# EAGLE design vfd (EAGLE 7.6.0)
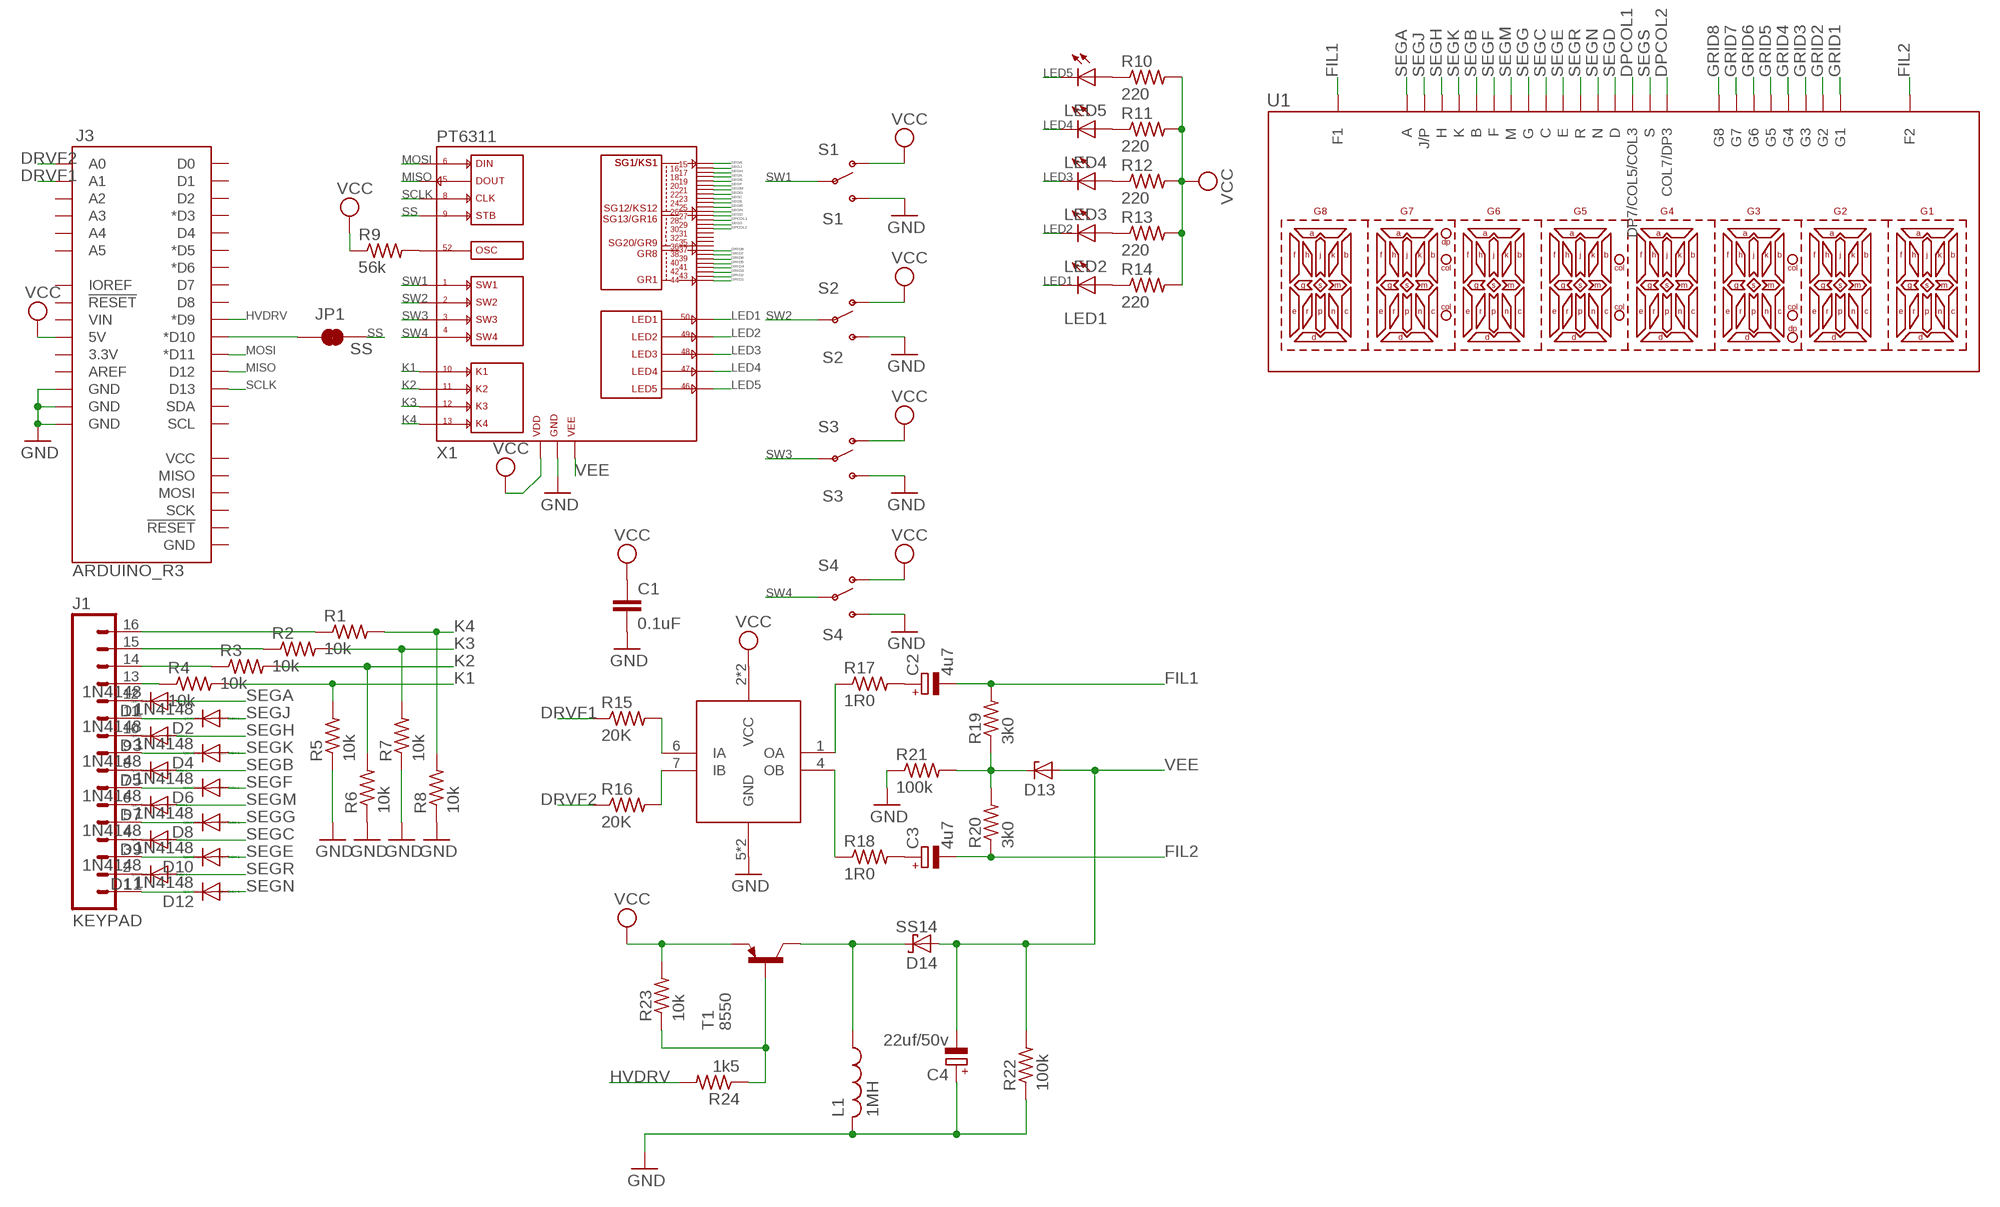
[diagram p0: schematic, sheet 1]

## Parts
C1  0.1uF  C-EU050-025X075  [C050-025X075]
C2  4u7  CPOL-EUB45181A  [B45181A]
C3  4u7  CPOL-EUB45181A  [B45181A]
C4  22uf/50v  CPOL-EUB45181A  [B45181A]
D1  1N4148  DIODE-D-5  [D-5]
D2  1N4148  DIODE-D-5  [D-5]
D3  1N4148  DIODE-D-5  [D-5]
D4  1N4148  DIODE-D-5  [D-5]
D5  1N4148  DIODE-D-5  [D-5]
D6  1N4148  DIODE-D-5  [D-5]
D7  1N4148  DIODE-D-5  [D-5]
D8  1N4148  DIODE-D-5  [D-5]
D9  1N4148  DIODE-D-5  [D-5]
D10  1N4148  DIODE-D-5  [D-5]
D11  1N4148  DIODE-D-5  [D-5]
D12  1N4148  DIODE-D-5  [D-5]
D13  ZENER-DIODEDO34-7  [DO34Z7]
D14  SS14  SCHOTTKY-DIODEDO35-7  [DO35-7]
J1  KEYPAD  M16PTH  [1X16]
J3  ARDUINO_R3  [ARDUINO_R3]
JP1  SS  JUMPER-PAD-2-NC_BY_TRACE  [PAD-JUMPER-2-NC_BY_TRACE_YES_SILK]
L1  1MH  L-US0204/5  [0204/5]
LED1  LED1  LED3MM  [LED3MM]
LED2  LED2  LED3MM  [LED3MM]
LED3  LED3  LED3MM  [LED3MM]
LED4  LED4  LED3MM  [LED3MM]
LED5  LED5  LED3MM  [LED3MM]
R1  10k  R-US_0204/7  [0204/7]
R2  10k  R-US_0204/7  [0204/7]
R3  10k  R-US_0204/7  [0204/7]
R4  10k  R-US_0204/7  [0204/7]
R5  10k  R-US_0204/5  [0204/5]
R6  10k  R-US_0204/5  [0204/5]
R7  10k  R-US_0204/5  [0204/5]
R8  10k  R-US_0204/5  [0204/5]
R9  56k  R-US_0204/5  [0204/5]
R10  220  R-US_0204/5  [0204/5]
R11  220  R-US_0204/5  [0204/5]
R12  220  R-US_0204/5  [0204/5]
R13  220  R-US_0204/5  [0204/5]
R14  220  R-US_0204/5  [0204/5]
R15  20K  R-US_0204/5  [0204/5]
R16  20K  R-US_0204/5  [0204/5]
R17  1R0  R-US_0204/5  [0204/5]
R18  1R0  R-US_0204/5  [0204/5]
R19  3k0  R-US_0204/7  [0204/7]
R20  3k0  R-US_0204/7  [0204/7]
R21  100k  R-US_0204/7  [0204/7]
R22  100k  R-US_0204/5  [0204/5]
R23  10k  R-US_0204/5  [0204/5]
R24  1k5  R-US_0204/5  [0204/5]
S1  S1  SWITCH-SPDTPTH  [SWITCH-SPDT]
S2  S2  SWITCH-SPDTPTH  [SWITCH-SPDT]
S3  S3  SWITCH-SPDTPTH  [SWITCH-SPDT]
S4  S4  SWITCH-SPDTPTH  [SWITCH-SPDT]
T1  8550  -PNP-TO92  [TO92]
U1  20070-1A04PTH  [20070-1A04]
U$1  L9110  [SOP8-1.27-5X3.6MM]
X1  DRV  PT6311  [QFP52]

## Nets
DPCOL1: U1.17(DP7/COL5/COL3) X1.P$28(SG14/GR15)
DPCOL2: U1.19(COL7/DP3) X1.P$30(SG16/GR13)
DRVF1: J3.A1 R15.1
DRVF2: J3.A0 R16.1
FIL1: C2.- R19.2 U1.1(F1) U1.2(F1)
FIL2: C3.- R20.1 U1.29(F2) U1.30(F2)
GND: C1.2 C4.+ J3.GND@2(GND) J3.GND@3(GND) J3.GND@4(GND) L1.2 R5.1 R6.1 R7.1 R8.1 R21.1 R22.1 S1.3(S) S2.3(S) S3.3(S) S4.3(S) U$1.5(GND) U$1.8(GND) X1.P$51(GND)
GRID1: U1.27(G1) X1.P$44(GR1)
GRID2: U1.26(G2) X1.P$43(GR2)
GRID3: U1.25(G3) X1.P$42(GR3)
GRID4: U1.24(G4) X1.P$41(GR4)
GRID5: U1.23(G5) X1.P$40(GR5)
GRID6: U1.22(G6) X1.P$39(GR6)
GRID7: U1.21(G7) X1.P$38(GR7)
GRID8: U1.20(G8) X1.P$37(GR8)
HVDRV: J3.D9(*D9) R24.2
K1: R4.2 R5.2 X1.P$10(K1)
K2: R3.2 R6.2 X1.P$11(K2)
K3: R2.2 R7.2 X1.P$12(K3)
K4: R1.2 R8.2 X1.P$13(K4)
LED1: LED1.K(C) X1.P$50(LED1)
LED2: LED2.K(C) X1.P$49(LED2)
LED3: LED3.K(C) X1.P$48(LED3)
LED4: LED4.K(C) X1.P$47(LED4)
LED5: LED5.K(C) X1.P$46(LED5)
MISO: J3.D12 X1.P$5(DOUT)
MOSI: J3.D11(*D11) X1.P$6(DIN)
N$1: D1.C J1.12
N$2: D2.C J1.11
N$3: D3.C J1.10
N$4: D4.C J1.9
N$5: D5.C J1.8
N$6: D6.C J1.7
N$7: D7.C J1.6
N$8: D8.C J1.5
N$9: D9.C J1.4
N$10: D10.C J1.3
N$11: D11.C J1.2
N$12: D12.C J1.1
N$13: J1.16 R1.1
N$15: J1.15 R2.1
N$16: J1.14 R3.1
N$17: J1.13 R4.1
N$18: J3.D10(*D10) JP1.1
N$20: R9.2 X1.P$52(OSC)
N$21: LED5.A R10.1
N$22: LED4.A R11.1
N$23: LED3.A R12.1
N$24: LED2.A R13.1
N$25: LED1.A R14.1
N$26: R15.2 U$1.6(IA)
N$27: R16.2 U$1.7(IB)
N$28: R17.1 U$1.1(OA)
N$29: R18.1 U$1.4(OB)
N$30: C2.+ R17.2
N$31: C3.+ R18.2
N$35: D13.C R19.1 R20.2 R21.2
N$36: R23.1 R24.1 T1.2(B)
N$40: D14.C L1.1 T1.3(C)
SCLK: J3.D13 X1.P$8(CLK)
SEGA: D1.A U1.4(A) X1.P$15(SG1/KS1)
SEGB: D5.A U1.8(B) X1.P$19(SG5/KS5)
SEGC: D9.A U1.12(C) X1.P$23(SG9/KS9)
SEGD: U1.16(D) X1.P$27(SG13/GR16)
SEGE: D10.A U1.13(E) X1.P$24(SG10/KS10)
SEGF: D6.A U1.9(F) X1.P$20(SG6/KS6)
SEGG: D8.A U1.11(G) X1.P$22(SG8/KS8)
SEGH: D3.A U1.6(H) X1.P$17(SG3/KS3)
SEGJ: D2.A U1.5(J/P) X1.P$16(SG2/KS2)
SEGK: D4.A U1.7(K) X1.P$18(SG4/KS4)
SEGM: D7.A U1.10(M) X1.P$21(SG7/KS7)
SEGN: D12.A U1.15(N) X1.P$26(SG12/KS12)
SEGR: D11.A U1.14(R) X1.P$25(SG11/KS11)
SEGS: U1.18(S) X1.P$29(SG15/GR14)
SS: JP1.2 X1.P$9(STB)
SW1: S1.2(P) X1.P$1(SW1)
SW2: S2.2(P) X1.P$2(SW2)
SW3: S3.2(P) X1.P$3(SW3)
SW4: S4.2(P) X1.P$4(SW4)
VCC: C1.1 J3.5V R9.1 R10.2 R11.2 R12.2 R13.2 R14.2 R23.2 S1.1(O) S2.1(O) S3.1(O) S4.1(O) T1.1(E) U$1.2(VCC) U$1.3(VCC) X1.P$14(VDD) X1.P$33(VDD) X1.P$45(VDD)
VEE: C4.- D13.A D14.A R22.2 X1.P$34(VEE)
Unconnected: J3.3.3V J3.A2 J3.A3 J3.A4 J3.A5 J3.AREF J3.D0 J3.D1 J3.D2 J3.D3(*D3) J3.D4 J3.D5(*D5) J3.D6(*D6) J3.D7 J3.D8 J3.GND@1(GND) J3.IOREF J3.MISO J3.MOSI J3.RESET@1(!RESET!) J3.RESET@2(!RESET!) J3.SCK J3.SCL J3.SDA J3.VCC J3.VIN X1.P$31(SG17/GR12) X1.P$32(SG18/GR11) X1.P$35(SG19/GR10) X1.P$36(SG20/GR9)

## Library data of the parts
C1 = resistor:C-EU: CAPACITOR, European symbol
C2-C4 = resistor:CPOL-EU: POLARIZED CAPACITOR, European symbol
D1-D12 = diode:DIODE-: DIODE
D13 = diode:ZENER-DIODE: Z-Diode
D14 = diode:SCHOTTKY-DIODE: Schottky Diode
J1 = SparkFun-Connectors:M16: 1x16 .1" header
J3 = SparkFun-Boards:ARDUINO_R3: Arduino R3 Footprint (w/ SPI header)
JP1 = SparkFun-Passives:JUMPER-PAD-2-NC_BY_TRACE
L1 = resistor:L-US: INDUCTOR, American symbol
LED1-LED5 = led:LED: LED OSRAM: - CHIPLED LG R971, LG N971, LY N971, LG Q971, LY Q971, LO R971, LY R971 LH N974, LH R974 LS Q976, LO Q976, LY Q976 LO Q996 - Hyper CHIPLED LW Q18S LB Q993, LB Q99A, LB R99A - SideLED LS A670, LO A670, LY A670, LG A670, LP A670 LB A673, LV A673, LT A673, LW A673 LH A674 LY A675 LS A676, LA A676, LO A676, LY A676, LW A676 LS A679, LY A679, LG A679 - Hyper Micro SIDELED® LS Y876, LA Y876, LO Y876, LY Y876 LT Y87S - SmartLED LW L88C, LW L88S LB L89C, LB L89S, LG L890 LS L89K, LO L89K, LY L89K LS L896, LA L896, LO L896, LY L896 - TOPLED LS T670, LO T670, LY T670, LG T670, LP T670 LSG T670, LSP T670, LSY T670, LOP T670, LYG T670 LG T671, LOG T671, LSG T671 LB T673, LV T673, LT T673, LW T673 LH T674 LS T676, LA T676, LO T676, LY T676, LB T676, LH T676, LSB T676, LW T676 LB T67C, LV T67C, LT T67C, LS T67K, LO T67K, LY T67K, LW E67C LS E67B, LA E67B, LO E67B, LY E67B, LB E67C, LV E67C, LT E67C LW T67C LS T679, LY T679, LG T679 LS T770, LO T770, LY T770, LG T770, LP T770 LB T773, LV T773, LT T773, LW T773 LH T774 LS E675, LA E675, LY E675, LS T675 LS T776, LA T776, LO T776, LY T776, LB T776 LHGB T686 LT T68C, LB T68C - Hyper Mini TOPLED® LB M676 - Mini TOPLED Santana® LG M470 LS M47K, LO M47K, LY M47K Source: http://www.osram.convergy.de LUXEON: - LUMILED® LXK2-PW12-R00, LXK2-PW12-S00, LXK2-PW14-U00, LXK2-PW14-V00 LXK2-PM12-R00, LXK2-PM12-S00, LXK2-PM14-U00 LXK2-PE12-Q00, LXK2-PE12-R00, LXK2-PE12-S00, LXK2-PE14-T00, LXK2-PE14-U00 LXK2-PB12-K00, LXK2-PB12-L00, LXK2-PB12-M00, LXK2-PB14-N00, LXK2-PB14-P00, LXK2-PB14-Q00 LXK2-PR12-L00, LXK2-PR12-M00, LXK2-PR14-Q00, LXK2-PR14-R00 LXK2-PD12-Q00, LXK2-PD12-R00, LXK2-PD12-S00 LXK2-PH12-R00, LXK2-PH12-S00 LXK2-PL12-P00, LXK2-PL12-Q00, LXK2-PL12-R00 Source: www.luxeon.com KINGBRIGHT: KA-3528ASYC Source: www.kingbright.com
R1-R24 = resistor:R-US_: RESISTOR, American symbol
S1-S4 = SparkFun-Electromechanical:SWITCH-SPDT: SPDT Switch Simple slide switch, Spark Fun Electronics SKU : COM-00102 DPDT SMT slide switch, AYZ0202, SWCH-08179; PROD_ID: SWCH-08261
T1 = transistor:*-PNP-: PNP Transistror
U1 = VFD:20070-1A04: AOTOM 20070-1A04 Alphanumeric VFD
U$1 = Drivers:L9110
X1 = Drivers:PT6311: PT6311 VFD Driver PT6311 is a Vacuum Fluorescent Display (VFD) Controller driven on a 1/8 to 1/16 duty factor housed in 52-pin plastic QFP Package. Twelve segment output lines, 8 grid output lines, 8 segment/grid output drive lines, one display memory, control circuit, key scan circuit are all incorporated into a single chip to build a highly reliable peripheral device for a single chip micro computer. Serial data is fed to PT6311 via a three-line serial interface.

## Board
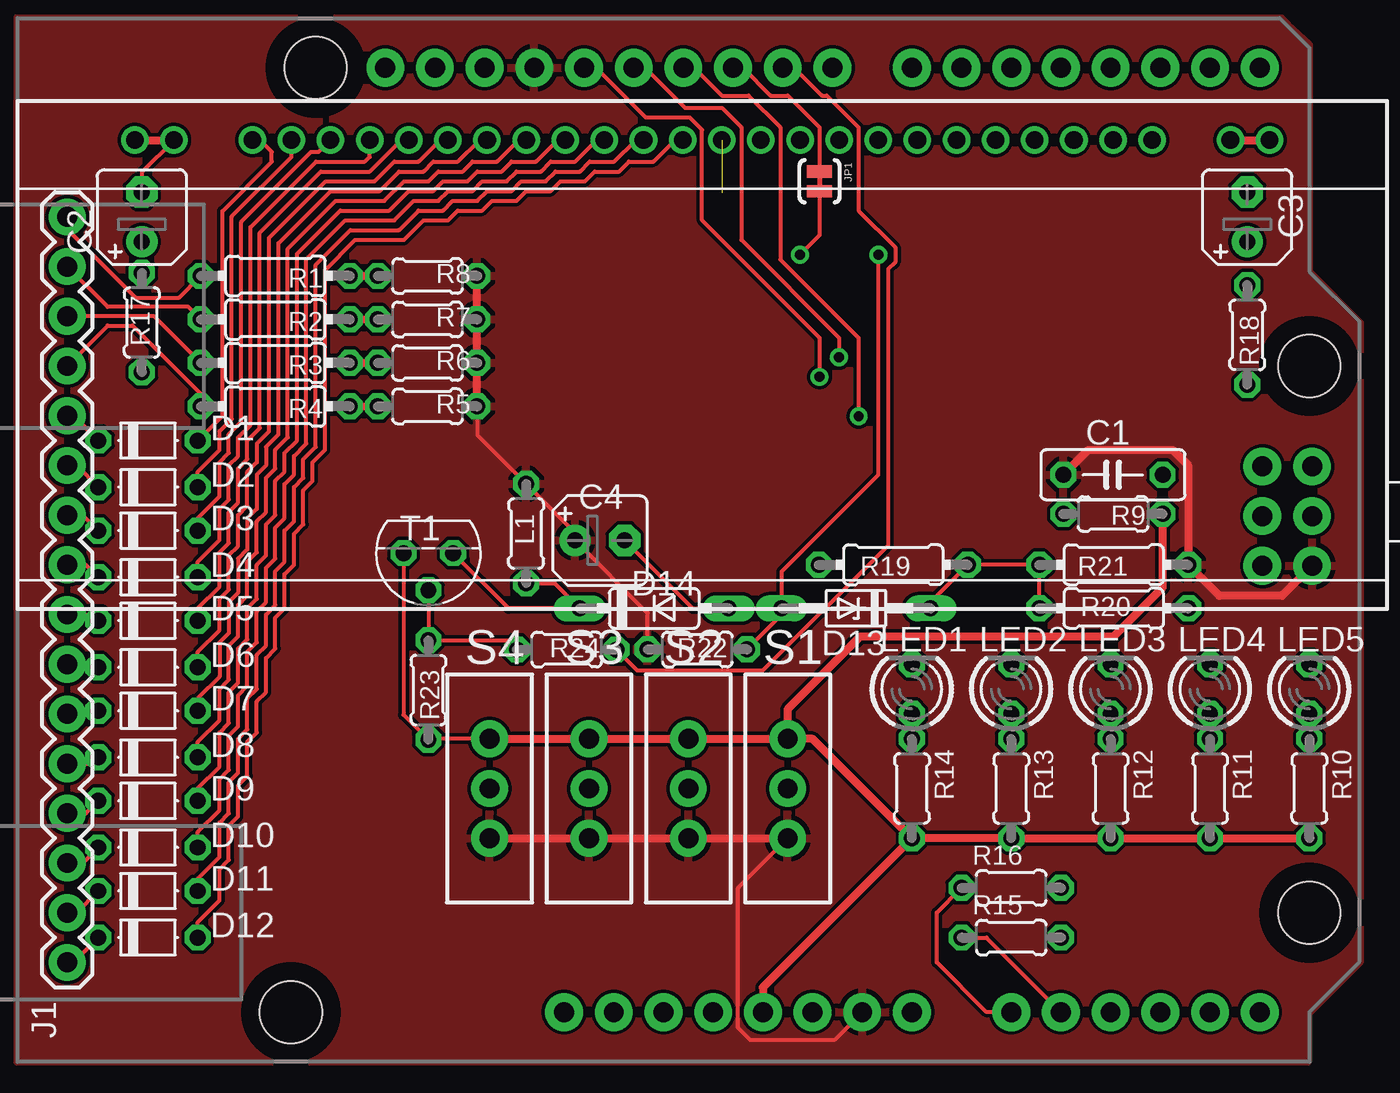
[diagram p1: board, top side]
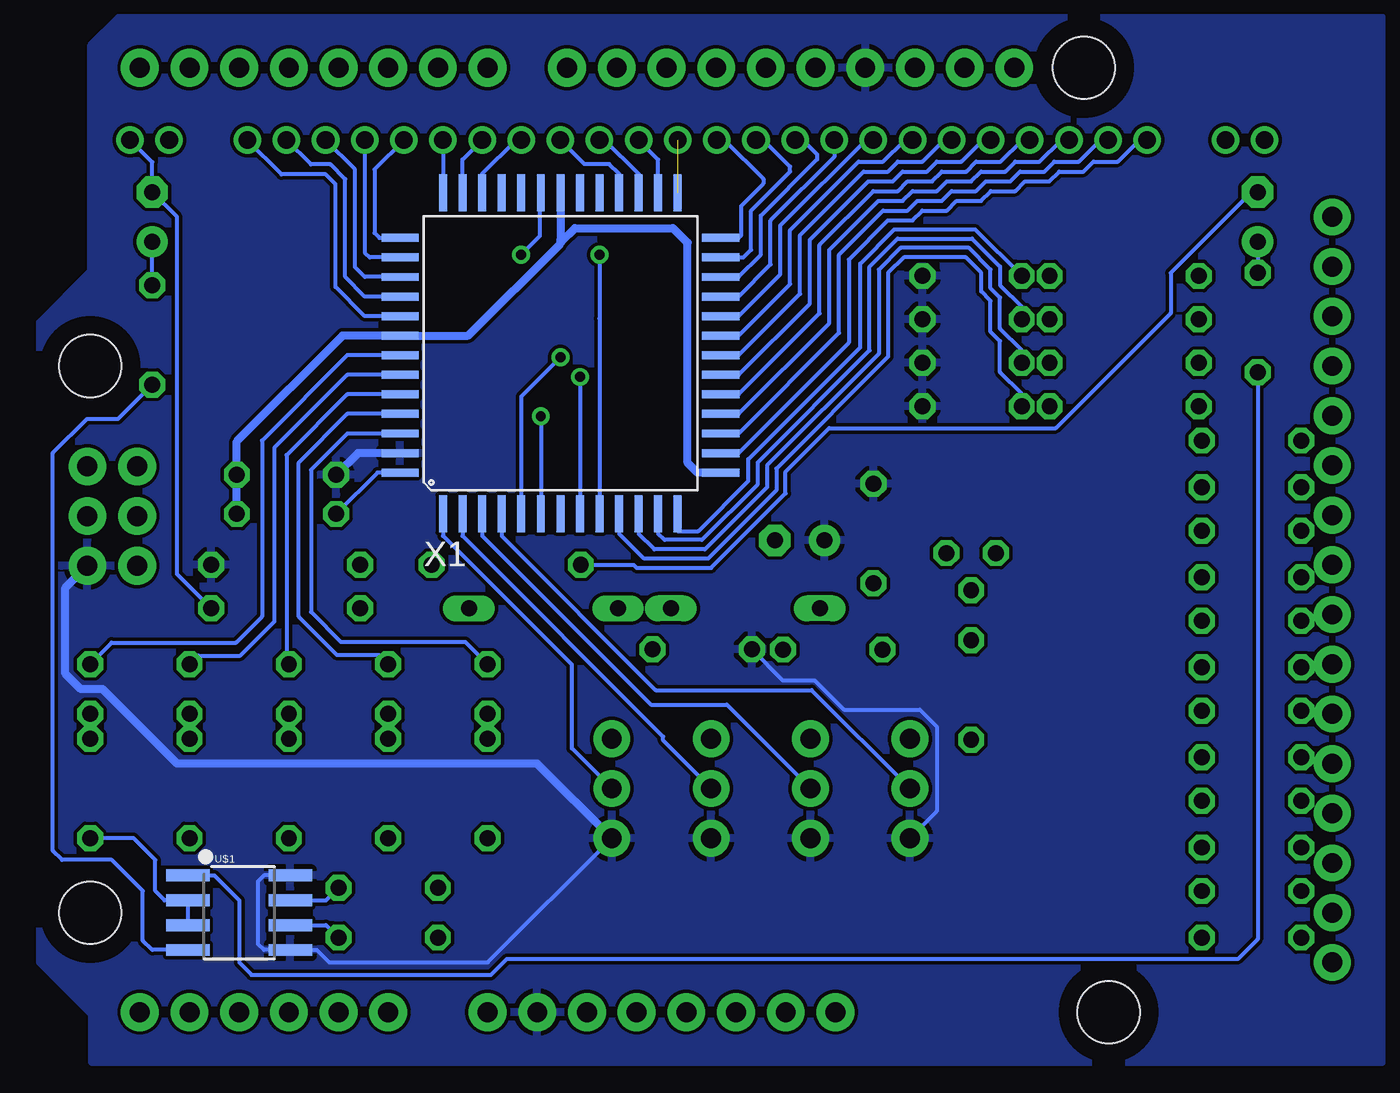
[diagram p2: board, bottom side, seen from below]

No outline drawn. Coordinates in mm, seen from the top.
Copper layers (1*16): Top 0.035mm / dielectric 1.5mm / Bottom 0.035mm
Design rules "default *": minimum track width 8mil, minimum drill 20mil, track to track 7mil, track to pad 7mil, pad to pad 7mil, via to via 7mil, smd to smd 7mil, copper to edge 38mil, drill to drill 8mil, minimum pad ring 10mil, minimum via ring 8mil, stop-mask expansion 4mil, vias tented up to drill 0mil, thermal gap 10mil

### Footprints (pad centres in the part's own frame; a part is rotated, then mirrored left to right if it is on the bottom)
C050-025X075 = drill 0.813 octagon: 1 -2.54,0; 2 2.54,0
B45181A = drill 0.813 pad 1.6: + -1.27,0 | drill 0.813 pad 1.6 octagon: - 1.27,0
D-5 = drill 0.813 octagon: A 2.54,0; C -2.54,0
DO34Z7 = drill 0.813 long: A 3.81,0; C -3.81,0
DO35-7 = drill 0.813 long: A 3.81,0; C -3.81,0
1X16 = drill 1.016 pad 1.88: 1 0,0; 2 2.54,0; 3 5.08,0; 4 7.62,0; 5 10.16,0; 6 12.7,0; 7 15.24,0; 8 17.78,0; 9 20.32,0; 10 22.86,0; 11 25.4,0; 12 27.94,0; 13 30.48,0; 14 33.02,0; 15 35.56,0; 16 38.1,0
ARDUINO_R3 = drill 1.016 pad 1.93: 3.3V 35.56,2.54; 5V 38.1,2.54; A0 50.8,2.54; A1 53.34,2.54; A2 55.88,2.54; A3 58.42,2.54; A4 60.96,2.54; A5 63.5,2.54; AREF 23.876,50.8; D0 63.5,50.8; D1 60.96,50.8; D2 58.42,50.8; D3 55.88,50.8; D4 53.34,50.8; D5 50.8,50.8; D6 48.26,50.8; D7 45.72,50.8; D8 41.656,50.8; D9 39.116,50.8; D10 36.576,50.8; D11 34.036,50.8; D12 31.496,50.8; D13 28.956,50.8; GND@1 40.64,2.54; GND@2 43.18,2.54; GND@3 26.416,50.8; GND@4 66.18,25.35; IOREF 30.48,2.54; MISO 63.64,30.43; MOSI 66.18,27.89; NC 27.94,2.54; RESET@1 33.02,2.54; RESET@2 63.64,25.35; SCK 63.64,27.89; SCL 18.796,50.8; SDA 21.336,50.8; VCC 66.18,30.43; VIN 45.72,2.54 | hole 3.175: 15.24,50.8; 66.04,35.56; 66.04,7.62; 13.97,2.54
PAD-JUMPER-2-NC_BY_TRACE_YES_SILK = smd 0.635 x 1.27: 1 -0.508,0; 2 0.508,0
0204/5 = drill 0.813 octagon: 1 -2.54,0; 2 2.54,0
LED3MM = drill 0.813 octagon: A -1.27,0; K 1.27,0
0204/7 = drill 0.813 octagon: 1 -3.81,0; 2 3.81,0
SWITCH-SPDT = drill 1.016 pad 1.88: 1 0,2.54; 2 0,0; 3 0,-2.54
TO92 = drill 0.813 octagon: 1 1.27,0; 2 0,1.905; 3 -1.27,0
20070-1A04 = drill 0.9: 1 6,24; 2 8,24; 4 12,24; 5 14,24; 6 16,24; 7 18,24; 8 20,24; 9 22,24; 10 24,24; 11 26,24; 12 28,24; 13 30,24; 14 32,24; 15 34,24; 16 36,24; 17 38,24; 18 40,24; 19 42,24; 20 44,24; 21 46,24; 22 48,24; 23 50,24; 24 52,24; 25 54,24; 26 56,24; 27 58,24; 29 62,24; 30 64,24
SOP8-1.27-5X3.6MM = smd 0.61 x 2.21: 1 -1.905,-2.616; 2 -0.635,-2.616; 3 0.635,-2.616; 4 1.905,-2.616; 5 1.905,2.616; 6 0.635,2.616; 7 -0.635,2.616; 8 -1.905,2.616
QFP52 = smd 0.406 x 1.9: P$1 -6,-8.1; P$2 -5,-8.1; P$3 -4,-8.1; P$4 -3,-8.1; P$5 -2,-8.1; P$6 -1,-8.1; P$7 0,-8.1; P$8 1,-8.1; P$9 2,-8.1; P$10 3,-8.1; P$11 4,-8.1; P$12 5,-8.1; P$13 6,-8.1; P$27 6,8.3; P$28 5,8.3; P$29 4,8.3; P$30 3,8.3; P$31 2,8.3; P$32 1,8.3; P$33 0,8.3; P$34 -1,8.3; P$35 -2,8.3; P$36 -3,8.3; P$37 -4,8.3; P$38 -5,8.3; P$39 -6,8.3 | smd 1.9 x 0.406: P$14 8.2,-6; P$15 8.2,-5; P$16 8.2,-4; P$17 8.2,-3; P$18 8.2,-2; P$19 8.2,-1; P$20 8.2,0; P$21 8.2,1; P$22 8.2,2; P$23 8.2,3; P$24 8.2,4; P$25 8.2,5; P$26 8.2,6; P$40 -8.2,6; P$41 -8.2,5; P$42 -8.2,4; P$43 -8.2,3; P$44 -8.2,2; P$45 -8.2,1; P$46 -8.2,0; P$47 -8.2,-1; P$48 -8.2,-2; P$49 -8.2,-3; P$50 -8.2,-4; P$51 -8.2,-5; P$52 -8.2,-6

### Placement (x,y rotation side)
C1  56,30 180 top
C2  6.35,43.18 90 top
C3  62.87,43.18 90 top
C4  29.77,26.65 0 top
D1  6.67,31.75 0 top
D2  6.67,29.37 0 top
D3  6.67,27.15 0 top
D4  6.67,24.77 0 top
D5  6.67,22.54 0 top
D6  6.67,20.16 0 top
D7  6.67,17.94 0 top
D8  6.67,15.56 0 top
D9  6.67,13.34 0 top
D10  6.67,10.95 0 top
D11  6.67,8.73 0 top
D12  6.67,6.35 0 top
D13  42.86,23.18 180 top
D14  32.54,23.18 0 top
J1  2.54,5.08 90 top
J3  0,0 0 top
JP1  41,45 270 top
L1  26,27 90 top
LED1  45.72,19.05 90 top
LED2  50.8,19.05 90 top
LED3  55.88,19.05 90 top
LED4  60.96,19.05 90 top
LED5  66.04,19.05 90 top
R1  13.18,40.16 0 top
R2  13.18,37.94 0 top
R3  13.18,35.72 0 top
R4  13.18,33.5 0 top
R5  20.95,33.5 180 top
R6  20.95,35.72 180 top
R7  20.95,37.94 180 top
R8  20.95,40.16 180 top
R9  56,28 180 top
R10  66.04,13.97 270 top
R11  60.96,13.97 270 top
R12  55.88,13.97 270 top
R13  50.8,13.97 270 top
R14  45.72,13.97 270 top
R15  50.8,6.35 0 top
R16  50.8,8.89 0 top
R17  6.35,37.78 90 top
R18  62.87,37.15 90 top
R19  44.77,25.4 180 top
R20  56.04,23.18 180 top
R21  56.04,25.4 180 top
R22  34.75,21.08 0 top
R23  21,19 270 top
R24  28.07,21.07 0 top
S1  39.37,13.97 0 top
S2  34.29,13.97 0 top
S3  29.21,13.97 0 top
S4  24.13,13.97 0 top
T1  21,26 180 top
U1  0,23.11 0 top
U$1  58.42,7.62 270 bottom
X1  42,36.11 0 bottom

### Tracks (layer width: path | path; a pad name or v marks a point on that pad's centre or on a via)
DPCOL1
  Bottom 0.203: X1.P$28 37,46.11 U1.17
DPCOL2
  Bottom 0.203: X1.P$30 39,45.38 39.5,45.88 40.77,45.88 U1.19
DRVF1
  Top 0.203: R15.1 49.53,6.35 J3.A1
DRVF2
  Top 0.203: J3.A0 49.53,2.54 46.99,5.08 46.99,7.62 R16.1
FIL1
  Top 0.203: U1.2 6.35,45.46 C2.-
  Top 0.406: U1.1 U1.2
  Bottom 0.203: C2.- 6.67,44.45 10.79,40.32 10.79,38.26 16.67,32.38 28.26,32.38 30.48,30.16 30.48,29.05 34.29,25.24 38.1,25.24 38.26,25.4 R19.2
FIL2
  Top 0.406: U1.29 U1.30
  Bottom 0.203: U1.30 62.87,45.98 C3.- 61.59,43.18 61.59,24.92 R20.1
GND
  Top 0.203: R5.1 23.5,32.05 L1.2 28.5,27.04 C4.+ 32.21,22.93 R22.1 | J3.GND@2 41.75,1.11 37.47,1.11 36.83,1.75 36.83,8.89 S1.3
  Top 0.406: S1.3 S2.3 S3.3 S4.3 | R5.1 R6.1 R7.1 R8.1 | J3.GND@4 64.64,23.81 61.44,23.81 R21.1 59.85,30.48 59.05,31.27 54.73,31.27 C1.2
  Bottom 0.203: U$1.8 57.15,9.53 57.47,9.21 57.47,6.03 57.15,5.71 U$1.5 54.45,5.71 53.82,5.08 45.72,5.08 S1.3 | R22.1 30.64,19.5 29,19.5 27.5,18 23.62,18 22.75,17.12 22.75,12.81 S4.3
  Bottom 0.406: X1.P$51 52.35,31.11 C1.2 | S1.3 43.18,15.24 61.59,15.24 65.41,19.05 66.52,19.05 67.31,19.84 67.31,24.22 J3.GND@4
  pour Bottom: 0,53.36 64.58,53.34 66,51.92 66,40.38 68.62,37.75 68.62,5.12 65.95,2.46 65.95,0 0,0
  pour Top: 0,53.36 64.58,53.34 64.92,53 66,52 66,40.38 68.62,37.75 68.62,5.12 65.95,2.46 65.95,0 0,0
GRID1
  Bottom 0.203: X1.P$44 52,38.11 53.5,39.61 53.5,44.86 54,45.36 56.25,45.36 U1.27
GRID2
  Bottom 0.203: X1.P$43 52,39.11 53,40.11 53,45.11 53.75,45.86 54.75,45.86 U1.26
GRID3
  Bottom 0.203: X1.P$42 52,40.11 52.5,40.61 52.5,45.61 U1.25
GRID4
  Bottom 0.203: U1.24 52,41.36 51.75,41.11 X1.P$41
GRID5
  Bottom 0.203: U1.23 51.5,45.61 51.5,42.36 51.25,42.11 X1.P$40
GRID6
  Bottom 0.203: U1.22 X1.P$39
GRID7
  Bottom 0.203: X1.P$38 47,46.11 U1.21
GRID8
  Bottom 0.203: X1.P$37 46,45.38 44.27,47.11 U1.20
HVDRV
  Top 0.203: R24.2 31.68,20 38.1,20 44.5,26.38 44.5,40.5 44.88,40.88 44.88,41.62 43,43.5 43,47.75 41.38,49.38 41.12,49.38 39.7,50.8 J3.D9
K1
  Top 0.406: R4.2 R5.2
  Bottom 0.203: R5.2 18.41,34.13 19.53,35.24 19.53,36.83 20,37.31 20,38.89 20.48,39.37 20.48,40.32 21.27,41.12 24.45,41.12 25.24,40.32 25.24,36.04 30.96,30.32 30.96,29.21 34.45,25.72 37.72,25.72 39,27 X1.P$10
K2
  Top 0.406: R3.2 R6.2
  Bottom 0.203: R6.2 18.41,36.35 19.53,37.47 19.53,39.05 20,39.53 20,40.48 21.11,41.59 24.61,41.59 25.72,40.48 25.72,36.2 31.43,30.48 31.43,29.37 34.61,26.19 37.19,26.19 38,27 X1.P$11
K3
  Top 0.406: R2.2 R7.2
  Bottom 0.203: R7.2 18.41,38.58 19.53,39.69 19.53,40.64 20.95,42.07 24.77,42.07 26.19,40.64 26.19,36.35 31.91,30.64 31.91,29.53 34.77,26.67 36.67,26.67 37,27 X1.P$12
K4
  Top 0.406: R1.2 R8.2
  Bottom 0.203: R8.2 20.8,42.55 24.92,42.55 26.67,40.8 26.67,36.51 32.38,30.8 32.38,29.69 34.95,27.12 36,27.12 X1.P$13
LED1
  Bottom 0.203: X1.P$50 52.89,32.11 54.75,30.25 54.75,23 53.2,21.45 46.85,21.45 LED1.K
LED2
  Bottom 0.203: X1.P$49 52.89,33.11 55.38,30.62 55.38,22.75 53.41,20.79 51.27,20.79 LED2.K
LED3
  Bottom 0.203: X1.P$48 52.89,34.11 56,31 56,20.44 LED3.K
LED4
  Bottom 0.203: X1.P$47 52.89,35.11 56.62,31.38 56.62,22.5 58.36,20.76 60.52,20.76 LED4.K
LED5
  Bottom 0.203: X1.P$46 52.89,36.11 57.25,31.75 57.25,22.75 58.58,21.42 64.94,21.42 LED5.K
MISO  (via drill 0.51)
  Top 0.203: v42,36 42,37 37,42 37,47.75 36,48.75 34.12,48.75 32.08,50.8 J3.D12
  Bottom 0.203: X1.P$5 44,34 v42,36
MOSI  (via drill 0.51)
  Top 0.203: v43,33 43,37 39,41 39,47.75 37.38,49.38 36,49.38 34.58,50.8 J3.D11
  Bottom 0.203: v43,33 X1.P$6
N$1
  Top 0.203: J1.12 2.86,33.02 D1.C
N$2
  Top 0.203: J1.11 3.02,30.48 D2.C
N$3
  Top 0.203: J1.10 3.33,27.94 D3.C
N$4
  Top 0.203: J1.9 3.49,25.4 D4.C
N$5
  Top 0.203: J1.8 3.81,22.86 D5.C
N$6
  Top 0.203: J1.7 3.97,20.32 D6.C
N$7
  Top 0.203: J1.6 3.97,17.78 D7.C
N$8
  Top 0.203: J1.5 3.81,15.24 D8.C
N$9
  Top 0.203: J1.4 3.49,12.7 D9.C
N$10
  Top 0.203: J1.3 3.33,10.16 D10.C
N$11
  Top 0.203: J1.2 3.02,7.62 D11.C
N$12
  Top 0.203: J1.1 2.86,5.08 D12.C
N$13
  Top 0.203: J1.16 2.54,42.55 6.03,39.05 8.26,39.05 R1.1
N$15
  Top 0.203: R2.1 8.73,38.58 4.6,38.58 J1.15
N$16
  Top 0.203: R3.1 6.99,38.1 J1.14
N$17
  Top 0.203: J1.13 4.6,37.62 5.87,37.62 9.37,34.13 R4.1
N$18
  Top 0.203: J3.D10 37.08,50.8 38.5,49.38 39.38,49.38 41,47.75 JP1.1
N$20
  Bottom 0.203: X1.P$52 51.35,30.11 R9.2
N$21
  Top 0.406: LED5.A R10.1
N$22
  Top 0.406: LED4.A R11.1
N$23
  Top 0.406: LED3.A R12.1
N$24
  Top 0.406: LED2.A R13.1
N$25
  Top 0.406: LED1.A R14.1
N$26
  Bottom 0.203: U$1.6 53.98,6.99 R15.2
N$27
  Bottom 0.203: U$1.7 53.98,8.26 R16.2
N$28
  Bottom 0.203: U$1.1 59.69,9.53 58.42,8.26 58.42,5.08 57.78,4.45 45.55,4.45 44.75,5.25 7.37,5.25 6.35,6.27 R17.1
N$29
  Bottom 0.203: U$1.4 62.87,5.71 63.34,6.19 63.34,8.73 64.93,10.32 67.47,10.32 67.94,10.79 67.94,31.11 66.2,32.86 64.61,32.86 R18.1
N$30
  Bottom 0.203: C2.+ R17.2
N$31
  Bottom 0.203: R18.2 C3.+
N$35
  Top 0.203: R20.2 R21.2 R19.1 46.67,23.5 D13.C
N$36
  Top 0.203: T1.2 R23.1 25.06,21.54 R24.1
N$40
  Top 0.203: T1.3 25.09,23.18 D14.C 27.45,24.46 L1.1
SCLK  (via drill 0.51)
  Top 0.203: v41,35 41,37 35,43 35,47.62 34.38,48.25 32.12,48.25 29.57,50.8 J3.D13
  Bottom 0.203: v41,35 X1.P$8
SEGA
  Top 0.203: U1.4 12.39,47.11 13,46.5 13,46 10.48,43.48 10.48,33.02 D1.A
  Bottom 0.203: U1.4 12.39,47.11 13.5,46 14.75,46 15.25,45.5 16.5,45.5 17,45 18.25,45 18.75,44.5 20,44.5 20.5,44 21.75,44 22.25,43.5 23.5,43.5 24,43 25.25,43 27.25,41 27.25,36.75 32.89,31.11 X1.P$15
SEGB
  Top 0.203: U1.8 19.61,47.11 18,45.5 15.5,45.5 12.38,42.38 12.38,32.38 11.75,31.75 11.75,30.8 11.27,30.32 11.27,28.57 10.79,28.1 10.79,26.51 10.32,26.04 10.32,24.29 9.21,23.18 D5.A
  Bottom 0.203: X1.P$19 32.89,35.11 29.25,38.75 29.25,42 26.25,45 25,45 24.5,45.5 23.25,45.5 22.75,46 21.5,46 20.39,47.11 U1.8
SEGC
  Top 0.203: U1.12 27.61,47.11 26.5,46 25.25,46 24.75,45.5 23.5,45.5 23,45 21.75,45 21.25,44.5 20,44.5 19,43.5 16.5,43.5 14.29,41.29 14.29,31.75 13.65,31.11 13.65,30.16 13.18,29.69 13.18,27.94 12.7,27.46 12.7,25.88 12.22,25.4 12.22,23.65 11.75,23.18 11.75,21.59 11.27,21.11 11.27,19.37 10.79,18.89 10.79,17.3 10.32,16.83 10.32,15.08 9.21,13.97 D9.A
  Bottom 0.203: X1.P$23 32.89,39.11 31.25,40.75 31.25,43 28,46.25 U1.12
SEGD  (1 unrouted)
SEGE
  Top 0.203: U1.13 29.61,47.11 28.5,46 27.25,46 26.75,45.5 25.5,45.5 25,45 23.75,45 23.25,44.5 22,44.5 21.5,44 20.25,44 19.25,43 16.75,43 14.76,41.01 14.76,31.59 14.13,30.96 14.13,30 13.65,29.53 13.65,27.78 13.18,27.3 13.18,25.72 12.7,25.24 12.7,23.5 12.22,23.02 12.22,21.43 11.75,20.95 11.75,19.21 11.27,18.73 11.27,17.14 10.79,16.67 10.79,14.92 10.32,14.45 10.32,12.86 9.21,11.75 D10.A
  Bottom 0.203: X1.P$24 32.89,40.11 31.75,41.25 31.75,43.25 28.88,46.12 28.88,46.38 29.61,47.11 U1.13
SEGF
  Top 0.203: U1.9 21.61,47.11 20.5,46 19.25,46 18.25,45 15.75,45 12.86,42.11 12.86,32.23 12.22,31.59 12.22,30.64 11.75,30.16 11.75,28.42 11.27,27.94 11.27,26.35 10.79,25.88 10.79,24.13 10.32,23.65 10.32,22.07 9.21,20.95 D6.A
  Bottom 0.203: X1.P$20 32.89,36.11 29.75,39.25 29.75,42.25 26.5,45.5 25.25,45.5 24.75,46 23.5,46 22.39,47.11 U1.9
SEGG
  Top 0.203: U1.11 25.61,47.11 24.5,46 23.25,46 22.75,45.5 21.5,45.5 21,45 19.75,45 18.75,44 16.25,44 13.81,41.56 13.81,31.91 13.18,31.27 13.18,30.32 12.7,29.84 12.7,28.1 12.22,27.62 12.22,26.04 11.75,25.56 11.75,23.81 11.27,23.34 11.27,21.75 10.79,21.27 10.79,19.53 10.32,19.05 10.32,17.46 9.21,16.35 D8.A
  Bottom 0.203: X1.P$22 32.89,38.11 30.75,40.25 30.75,42.75 26.39,47.11 U1.11
SEGH
  Top 0.203: U1.6 15.39,46.5 15,46.5 11.43,42.93 11.43,32.7 10.79,32.07 10.79,31.11 10.32,30.64 10.32,28.89 9.21,27.78 D3.A
  Bottom 0.203: X1.P$17 32.89,33.11 28.25,37.75 28.25,41.5 25.75,44 24.5,44 24,44.5 22.75,44.5 22.25,45 21,45 20.5,45.5 19.25,45.5 18.75,46 17.5,46 16.39,47.11 U1.6
SEGJ
  Top 0.203: U1.5 14,46.25 10.95,43.2 10.95,32.86 10.32,32.23 10.32,31.27 9.21,30.16 D2.A
  Bottom 0.203: X1.P$16 32.89,32.11 27.75,37.25 27.75,41.25 25.5,43.5 24.25,43.5 23.75,44 22.5,44 22,44.5 20.75,44.5 20.25,45 19,45 18.5,45.5 17.25,45.5 16.75,46 15.5,46 14.39,47.11 U1.5
SEGK
  Top 0.203: U1.7 18,46.25 17.75,46 15.25,46 11.91,42.66 11.91,32.54 11.27,31.91 11.27,30.96 10.79,30.48 10.79,28.73 10.32,28.26 10.32,26.67 9.21,25.56 D4.A
  Bottom 0.203: 34,34.11 X1.P$18 32.89,34.11 28.75,38.25 28.75,41.75 26,44.5 24.75,44.5 24.25,45 23,45 22.5,45.5 21.25,45.5 20.75,46 19.5,46 18.39,47.11 U1.7
SEGM
  Top 0.203: U1.10 23.61,47.11 22.5,46 21.25,46 20.75,45.5 19.5,45.5 18.5,44.5 16,44.5 13.34,41.84 13.34,32.07 12.7,31.43 12.7,30.48 12.22,30 12.22,28.26 11.75,27.78 11.75,26.19 11.27,25.72 11.27,23.97 10.79,23.5 10.79,21.91 10.32,21.43 10.32,19.68 9.21,18.57 D7.A
  Bottom 0.203: X1.P$21 32.89,37.11 30.25,39.75 30.25,42.5 26.75,46 25.5,46 24.39,47.11 U1.10
SEGN
  Top 0.203: U1.15 33.61,47.11 32.5,46 31.25,46 30.75,45.5 29.5,45.5 29,45 27.75,45 27.25,44.5 26,44.5 25.5,44 24.25,44 23.75,43.5 22.5,43.5 22,43 20.75,43 19.75,42 17.25,42 15.72,40.47 15.72,31.27 15.08,30.64 15.08,29.69 14.61,29.21 14.61,27.46 14.13,26.99 14.13,25.4 13.65,24.92 13.65,23.18 13.18,22.7 13.18,21.11 12.7,20.64 12.7,18.89 12.22,18.41 12.22,16.83 11.75,16.35 11.75,14.61 11.27,14.13 11.27,12.54 10.79,12.06 10.79,10.32 10.32,9.84 10.32,8.26 9.21,7.14 D12.A
  Bottom 0.203: U1.15 33.61,47.11 31.62,45.12 31.62,44.88 32.75,43.75 32.75,42.25 32.89,42.11 X1.P$26
SEGR
  Top 0.203: U1.14 31.61,47.11 30.5,46 29.25,46 28.75,45.5 27.5,45.5 27,45 25.75,45 25.25,44.5 24,44.5 23.5,44 22.25,44 21.75,43.5 20.5,43.5 19.5,42.5 17,42.5 15.24,40.74 15.24,31.43 14.61,30.8 14.61,29.84 14.13,29.37 14.13,27.62 13.65,27.15 13.65,25.56 13.18,25.08 13.18,23.34 12.7,22.86 12.7,21.27 12.22,20.8 12.22,19.05 11.75,18.57 11.75,16.99 11.27,16.51 11.27,14.76 10.79,14.29 10.79,12.7 10.32,12.22 10.32,10.48 9.21,9.37 D11.A
  Bottom 0.203: X1.P$25 32.64,41.11 32.25,41.5 32.25,43.5 30.25,45.5 30.25,45.75 31.61,47.11 U1.14
SEGS
  Bottom 0.203: X1.P$29 38,45.38 39.73,47.11 U1.18
SS  (via drill 0.51)
  Top 0.203: JP1.2 41,42.25 v40,41.25
  Bottom 0.203: v40,41.25 40,38 40.01,28.19 X1.P$9
SW1
  Bottom 0.203: X1.P$1 48,26.88 41.41,20.29 41.41,16.02 S1.2
SW2
  Bottom 0.203: X1.P$2 47,26.88 36.75,16.62 36.75,16.43 S2.2
SW3
  Bottom 0.203: X1.P$3 46,26.88 37.38,18.25 33.49,18.25 S3.2
SW4
  Bottom 0.203: X1.P$4 45,26.88 37.12,19 29.16,19 S4.2
VCC
  Top 0.203: T1.1 19.73,17.73 R23.2 21.05,16.51 S4.1
  Top 0.406: S4.1 S3.1 S2.1 S1.1 | R10.2 R11.2 R12.2 R13.2 R14.2 | R9.1 58.54,24.25 56.04,21.75 43.1,21.75 39.37,18.02 S1.1 | R14.2 40.64,16.51 S1.1 | R14.2 38.1,3.81 J3.5V
  Bottom 0.203: U$1.3 61.04,8.01 61.28,8.26 62.23,8.26 62.71,8.73 62.71,10.32 63.82,11.43 R10.2
  Bottom 0.406: X1.P$14 35,30.11 35.5,30.61 35.5,41.86 36.25,42.61 41.25,42.61 41.93,41.93 | R9.1 C1.1 58.54,31.71 53.14,37.11 X1.P$45 46.71,37.11 42,41.82 42,41.86 41.93,41.93 | X1.P$33 42,42 41.93,41.93
VEE  (via drill 0.51)
  Top 0.203: v44,41.25 44,30 39.05,25.05 D13.A | D13.A D14.A 34.51,23.18 C4.- | R22.2 39.05,22.84 D13.A
  Bottom 0.203: X1.P$34 43.05,44.39 43.05,42.2 v44,41.25